# EAGLE schematic TPA6132A2RTER (EAGLE 9.4.2)
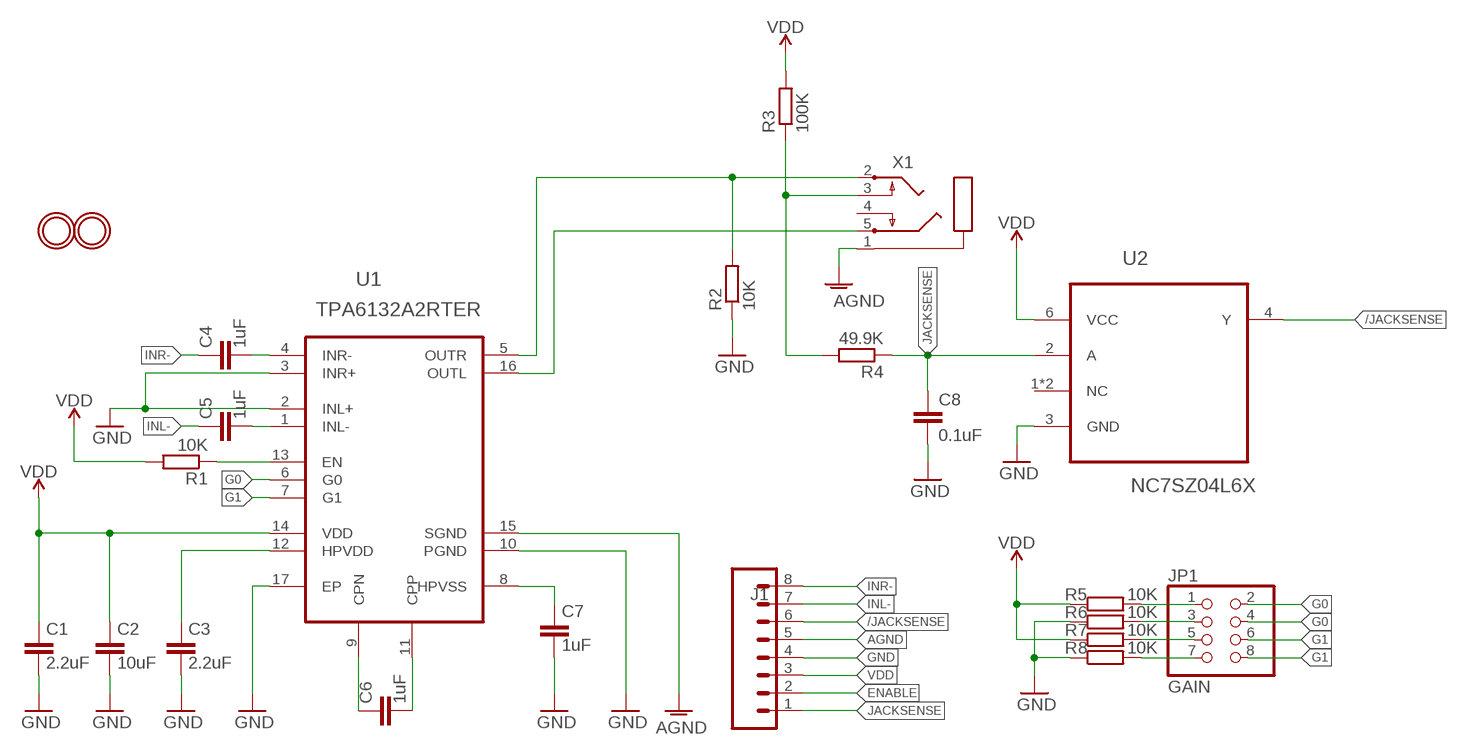
[diagram p0: schematic, sheet 1]

## Parts
C1  2.2uF  C-EUC0402K  [C0402K]
C2  10uF  C-EUC0402K  [C0402K]
C3  2.2uF  C-EUC0402K  [C0402K]
C4  1uF  C-EUC0402K  [C0402K]
C5  1uF  C-EUC0402K  [C0402K]
C6  1uF  C-EUC0402K  [C0402K]
C7  1uF  C-EUC0402K  [C0402K]
C8  0.1uF  C-EUC0402K  [C0402K]
J1  CONN_08NO_SILK_FEMALE_PTH  [1X08_NO_SILK]
JP1  GAIN  PINHD-2X4  [2X04]
MH1  MOUNTINGHOLE2.5  [MOUNTINGHOLE_2.5_PLATED]
MH2  MOUNTINGHOLE2.5  [MOUNTINGHOLE_2.5_PLATED]
R1  10K  R-EU_R0402  [R0402]
R2  10K  R-EU_R0402  [R0402]
R3  100K  R-EU_R0402  [R0402]
R4  49.9K  R-EU_R0402  [R0402]
R5  10K  R-EU_R0402  [R0402]
R6  10K  R-EU_R0402  [R0402]
R7  10K  R-EU_R0402  [R0402]
R8  10K  R-EU_R0402  [R0402]
U1  TPA6132A2RTER  [QFN50P300X300X80-16N]
U2  NC7SZ04L6X  [MICROPAK-6]
X1  STEREOJACKSTX3120-5B  [STX3100]

## Nets
/JACKSENSE: J1.6 U2.4(Y)
AGND: J1.5 U1.15(SGND) X1.1
ENABLE: J1.2 R1.1 U1.13(EN)
G0: JP1.2 JP1.4 U1.6(G0)
G1: JP1.6 JP1.8 U1.7(G1)
GND [power1]: C1.2 C2.2 C3.2 C7.2 C8.2 J1.4 R2.1 R6.1 R8.1 U1.2(INL+) U1.3(INR+) U1.10(PGND) U1.17(EP) U2.3(GND)
INL-: C5.1 J1.7
INR-: C4.1 J1.8
JACKSENSE: C8.1 J1.1 R4.1 U2.2(A)
N$1: C6.2 U1.11(CPP)
N$2: C6.1 U1.9(CPN)
N$3: JP1.3 R6.2
N$4: JP1.7 R8.2
N$5: C5.2 U1.1(INL-)
N$7: C3.1 U1.12(HPVDD)
N$9: C7.1 U1.8(HPVSS)
N$24: JP1.1 R5.2
N$25: JP1.5 R7.2
N$27: R3.1 R4.2 X1.3
N$100: C4.2 U1.4(INR-)
OUTL: U1.16(OUTL) X1.5
OUTR: R2.2 U1.5(OUTR) X1.2
VDD: C1.1 C2.1 J1.3 R1.2 R3.2 R5.1 R7.1 U1.14(VDD) U2.6(VCC)
Unconnected: U2.1(NC) U2.5(NC) X1.4

## Library data of the parts
C1-C8 = rcl:C-EU: CAPACITOR, European symbol; SPICEPREFIX: C
J1 = SparkFun-Connectors:CONN_08: Multi connection point. Often used as Generic Header-pin footprint for 0.1 inch spaced/style header connections On any of the 0.1 inch spaced packages, you can populate with these: Break Away Headers - Straight <https://www.sparkfun.com/products/116> (PRT-00116) Break Away Male Headers - Right Angle <https://www.sparkfun.com/products/553> (PRT-00553) Female Headers <https://www.sparkfun.com/products/115> (PRT-00115) Break Away Headers - Machine Pin <https://www.sparkfun.com/products/117> (PRT-00117) Break Away Female Headers - Swiss Machine Pin <https://www.sparkfun.com/products/743> (PRT-00743) Arduino Stackable Header - 8 Pin <https://www.sparkfun.com/products/9279> (PRT-09279) For SCREWTERMINALS and SPRING TERMINALS visit here: Screw Terimnals on SparkFun.com <https://www.sparkfun.com/search/results?term=Screw+Terminals> (5mm/3.5mm/2.54mm spacing) This device is also useful as a general connection point to wire up your design to another part of your project. Our various solder wires solder well into these plated through hole pads. Hook-Up Wire - Assortment (Stranded, 22 AWG) <https://www.sparkfun.com/products/11375> (PRT-11375) Hook-Up Wire - Assortment (Solid Core, 22 AWG) <https://www.sparkfun.com/products/11367> (PRT-11367) View the entire wire category on our website here <https://www.sparkfun.com/categories/141> Special notes: Molex polarized connector foot print use with SKU : PRT-08231 with associated crimp pins and housings. 1MM SMD Version SKU: PRT-10208 NOTES ON THE VARIANTS LOCK and LOCK_LONGPADS... This footprint was designed to help hold the alignment of a through-hole component (i.e. 6-pin header) while soldering it into place. You may notice that each hole has been shifted either up or down by 0.005 of an inch from it's more standard position (which is a perfectly straight line). This slight alteration caused the pins (the squares in the middle) to touch the edges of the holes. Because they are alternating, it causes a "brace" to hold the component in place. 0.005 has proven to be the perfect amount of "off-center" position when using our standard breakaway headers. Although looks a little odd when you look at the bare footprint, once you have a header in there, the alteration is very hard to notice. Also,if you push a header all the way into place, it is covered up entirely on the bottom side.; PROD_ID: CONN-08438
JP1 = pinhead:PINHD-2X4: PIN HEADER
MH1 MH2 = microbuilder:MOUNTINGHOLE: Mounting Hole For #2 screws (0.086"/2.18mm width, 0.094"/2.4mm hole) use 2.5mm
R1-R8 = rcl:R-EU_: RESISTOR, European symbol; SPICEPREFIX: R
U1 = TPA6132A2RTER:TPA6132A2RTER: 25-mW DIRECTPATH? STEREO HEADPHONE AMPLIFIER WITH POP SUPPRESSION; AVAILABILITY: Unavailable; DESCRIPTION: 25-mW DirectPath Stereo Headphone Amplifier with Pop Suppression _TPA6132_ 16-WQFN -40 to 85; MF: Texas Instruments; MP: TPA6132A2RTER; PACKAGE: WQFN-16 Texas Instruments; PRICE: None
U2 = AK74:NC7SZ04L6X
X1 = AK74:STEREOJACK: MIC/HEADPHONE JACK Stereo jack with two switches. Kycon STX3100, CUI SJ1-3555NG and/or 4UCon 05544

## Net classes
1 power1: width 0.254 mm